# EasyEDA schematic SCH Token Function.json
TITLE: Token Function; REV: 1.0; Date: 2025-01-18; Sheet: 1/1; Company: OneOneZero
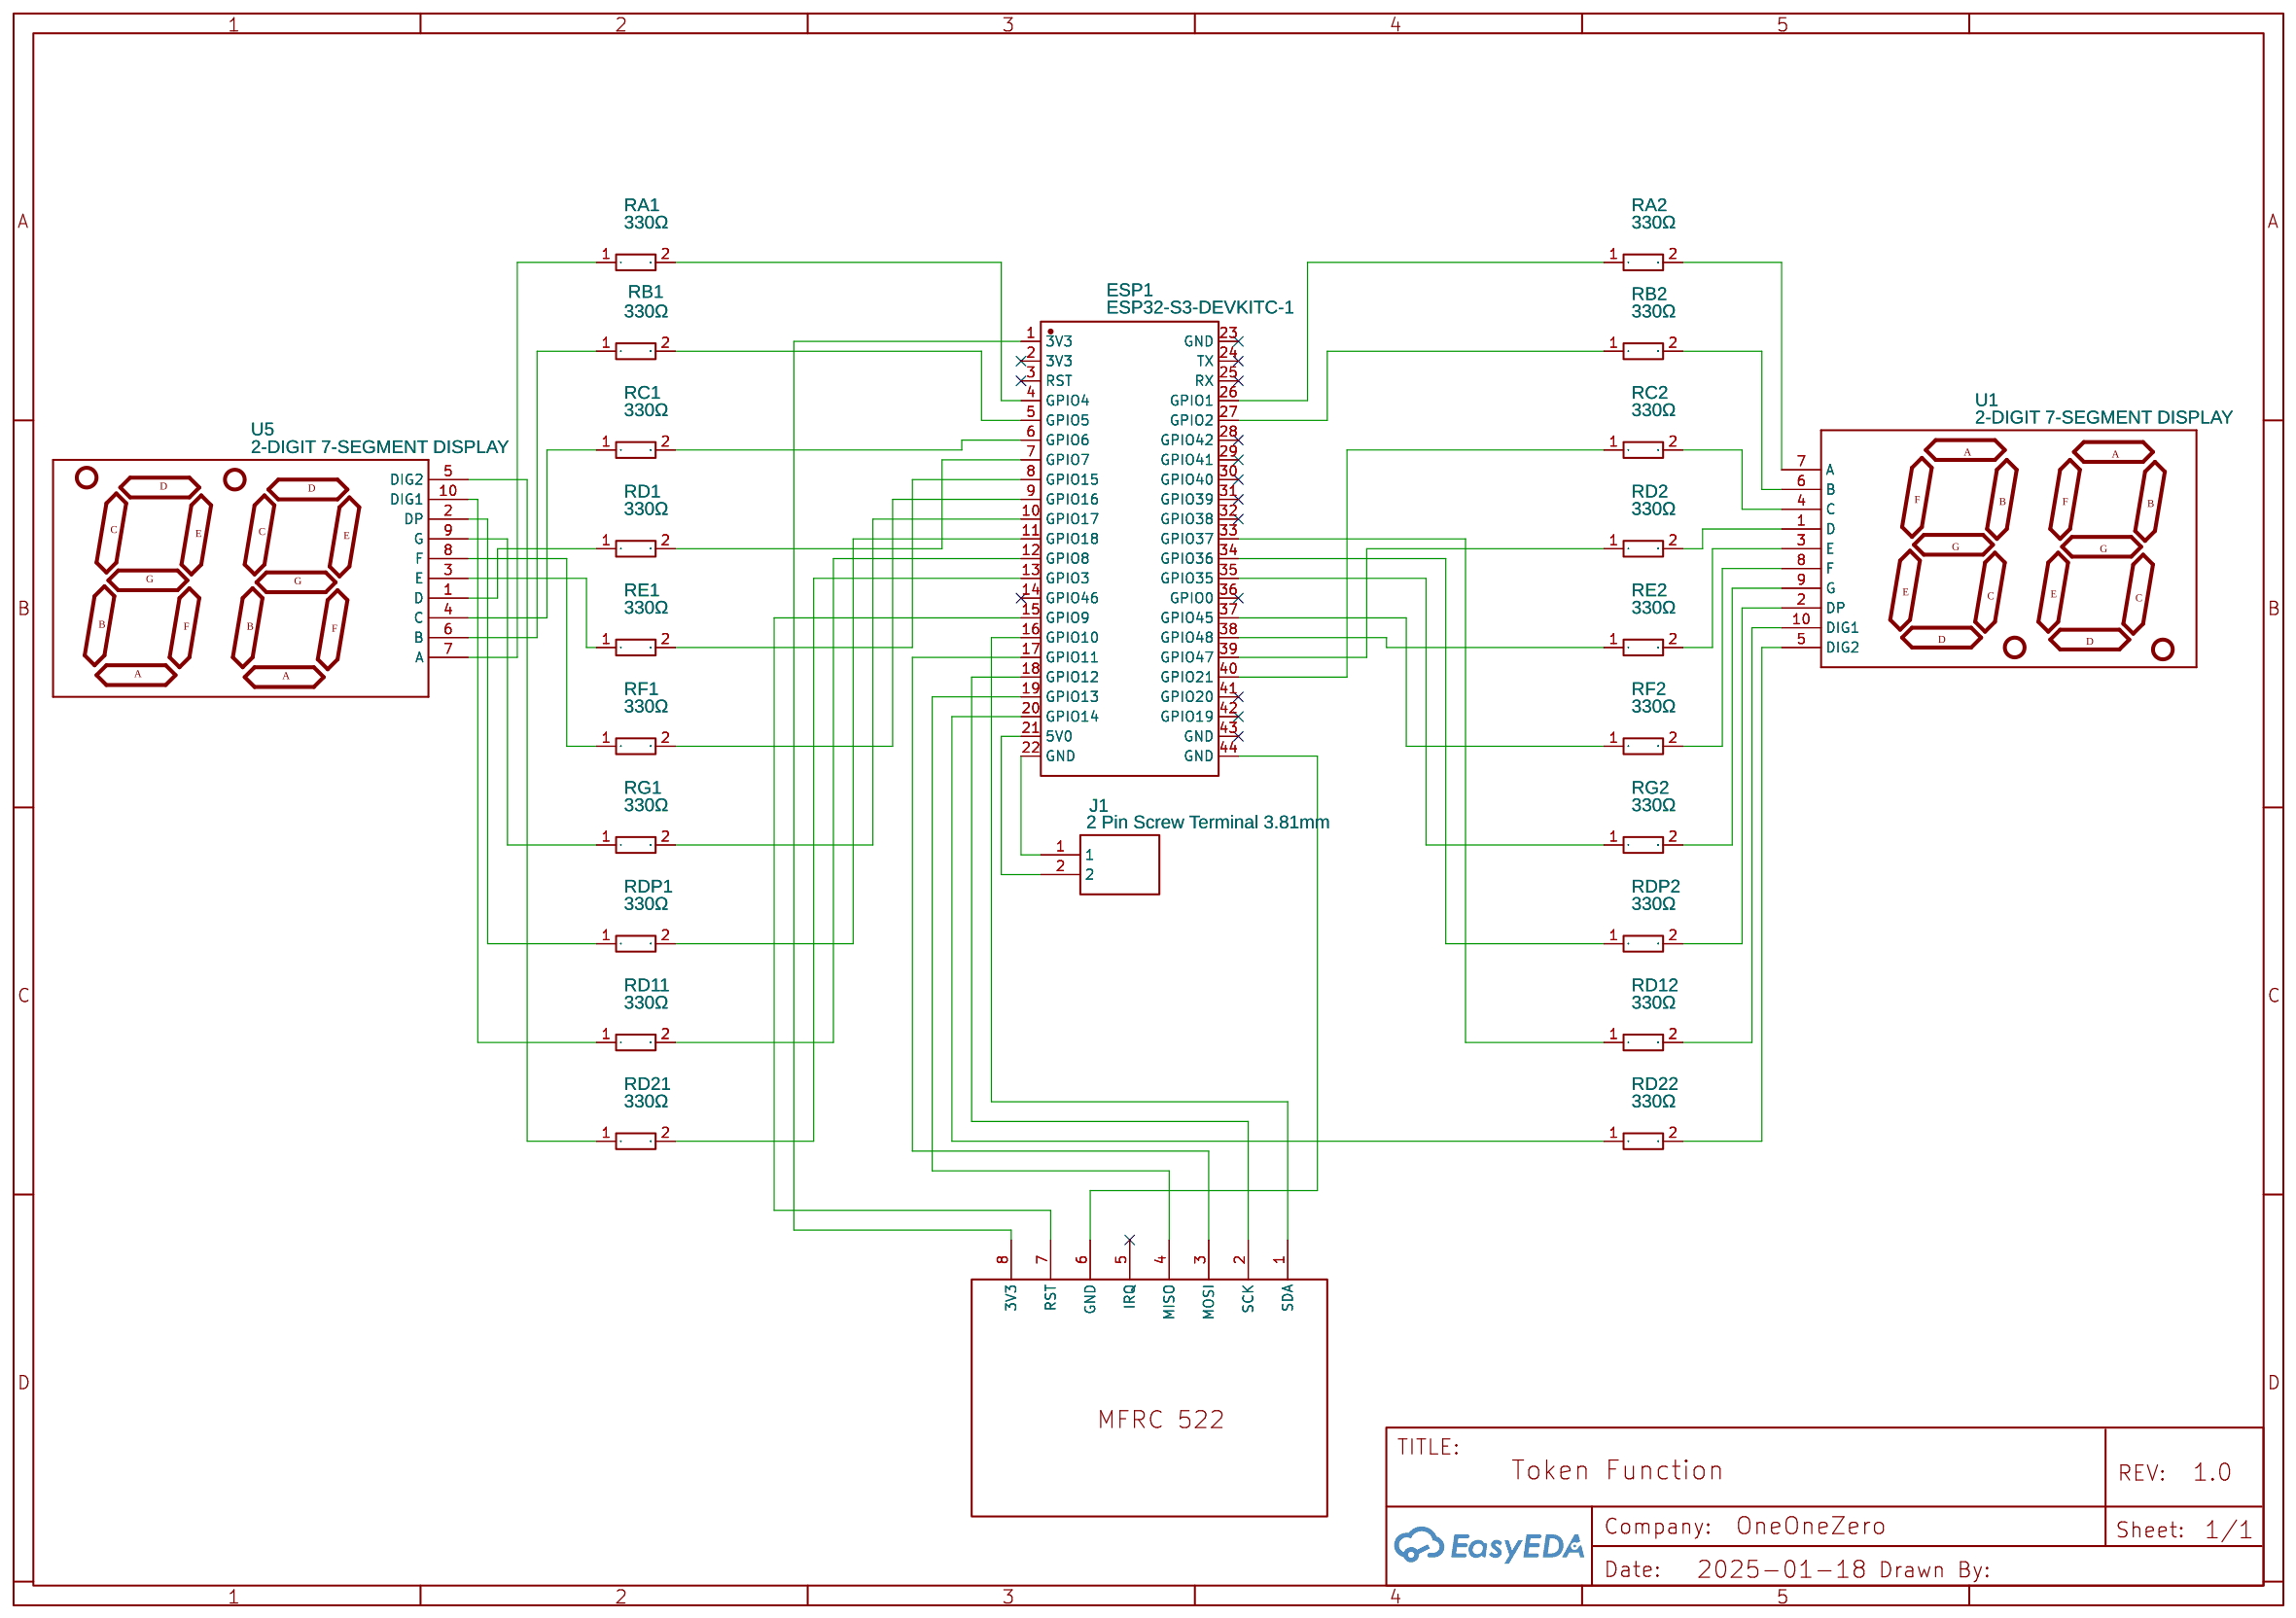
[diagram p0: schematic sheet]

## Parts
ESP1  ESP32-S3-DEVKITC-1  [ESP32-S3-DEVKITC-1]
J1  2 Pin Screw Terminal 3.81mm  [SCREW_TERMINAL_2PIN_3.81MMPITCH_F0.8]
RA1  330Ω  [V2-330Ω-THROUGH-HOLE-RESISTORS-5%-1/4W-D2.3-L6.5MM-FP]
RA2  330Ω  [V2-330Ω-THROUGH-HOLE-RESISTORS-5%-1/4W-D2.3-L6.5MM-FP]
RB1  330Ω  [V2-330Ω-THROUGH-HOLE-RESISTORS-5%-1/4W-D2.3-L6.5MM-FP]
RB2  330Ω  [V2-330Ω-THROUGH-HOLE-RESISTORS-5%-1/4W-D2.3-L6.5MM-FP]
RC1  330Ω  [V2-330Ω-THROUGH-HOLE-RESISTORS-5%-1/4W-D2.3-L6.5MM-FP]
RC2  330Ω  [V2-330Ω-THROUGH-HOLE-RESISTORS-5%-1/4W-D2.3-L6.5MM-FP]
RD1  330Ω  [V2-330Ω-THROUGH-HOLE-RESISTORS-5%-1/4W-D2.3-L6.5MM-FP]
RD2  330Ω  [V2-330Ω-THROUGH-HOLE-RESISTORS-5%-1/4W-D2.3-L6.5MM-FP]
RD11  330Ω  [V2-330Ω-THROUGH-HOLE-RESISTORS-5%-1/4W-D2.3-L6.5MM-FP]
RD12  330Ω  [V2-330Ω-THROUGH-HOLE-RESISTORS-5%-1/4W-D2.3-L6.5MM-FP]
RD21  330Ω  [V2-330Ω-THROUGH-HOLE-RESISTORS-5%-1/4W-D2.3-L6.5MM-FP]
RD22  330Ω  [V2-330Ω-THROUGH-HOLE-RESISTORS-5%-1/4W-D2.3-L6.5MM-FP]
RDP1  330Ω  [V2-330Ω-THROUGH-HOLE-RESISTORS-5%-1/4W-D2.3-L6.5MM-FP]
RDP2  330Ω  [V2-330Ω-THROUGH-HOLE-RESISTORS-5%-1/4W-D2.3-L6.5MM-FP]
RE1  330Ω  [V2-330Ω-THROUGH-HOLE-RESISTORS-5%-1/4W-D2.3-L6.5MM-FP]
RE2  330Ω  [V2-330Ω-THROUGH-HOLE-RESISTORS-5%-1/4W-D2.3-L6.5MM-FP]
RF1  330Ω  [V2-330Ω-THROUGH-HOLE-RESISTORS-5%-1/4W-D2.3-L6.5MM-FP]
RF2  330Ω  [V2-330Ω-THROUGH-HOLE-RESISTORS-5%-1/4W-D2.3-L6.5MM-FP]
RG1  330Ω  [V2-330Ω-THROUGH-HOLE-RESISTORS-5%-1/4W-D2.3-L6.5MM-FP]
RG2  330Ω  [V2-330Ω-THROUGH-HOLE-RESISTORS-5%-1/4W-D2.3-L6.5MM-FP]
U1  2-DIGIT 7-SEGMENT DISPLAY  [2 DIGIT]
U2  MFRC522-MODULE-FLIPPED  [MFRC522-MODULE-FLIPPED]
U5  2-DIGIT 7-SEGMENT DISPLAY  [2 DIGIT]

## Library data of the parts
ESP1 = ESP32-S3-DEVKITC-1: Contributor: lshutterli
J1 = 2 Pin Screw Terminal 3.81mm: Contributor: piazza
RA1 RA2 RB1 RB2 RC1 RC2 RD1 RD2 RD11 RD12 RD21 RD22 RDP1 RDP2 RE1 RE2 RF1 RF2 RG1 RG2 = V2-330Ω-THROUGH-HOLE-RESISTORS-5%-1/4W-D2.3-L6.5MM: Contributor: LCSC; Supplier: LCSC; Supplier Part: C119313; Manufacturer: CCO(千志电子); Manufacturer Part: MF1/4W-330Ω±1% T; JLCPCB Part Class: Extended Part
U1 U5 = 2-DIGIT 7-SEGMENT DISPLAY: Contributor: Ra.hulk
U2 = MFRC522-MODULE-FLIPPED: Contributor: flzurhorst

## Nets
Net-(ESP1-1): ESP1.1(3V3) U2.8(3V3)
Net-(ESP1-4): ESP1.4(GPIO4) RA1.2
Net-(ESP1-5): ESP1.5(GPIO5) RB1.2
Net-(ESP1-6): ESP1.6(GPIO6) RC1.2
Net-(ESP1-7): ESP1.7(GPIO7) RD1.2
Net-(ESP1-8): ESP1.8(GPIO15) RE1.2
Net-(ESP1-9): ESP1.9(GPIO16) RF1.2
Net-(ESP1-10): ESP1.10(GPIO17) RG1.2
Net-(ESP1-11): ESP1.11(GPIO18) RDP1.2
Net-(ESP1-12): ESP1.12(GPIO8) RD11.2
Net-(ESP1-13): ESP1.13(GPIO3) RD21.2
Net-(ESP1-15): ESP1.15(GPIO9) U2.7(RST)
Net-(ESP1-16): ESP1.16(GPIO10) U2.1(SDA)
Net-(ESP1-17): ESP1.17(GPIO11) U2.3(MOSI)
Net-(ESP1-18): ESP1.18(GPIO12) U2.2(SCK)
Net-(ESP1-19): ESP1.19(GPIO13) U2.4(MISO)
Net-(ESP1-20): ESP1.20(GPIO14) RD22.1
Net-(ESP1-21): ESP1.21(5V0) J1.2
Net-(ESP1-22): ESP1.22(GND) J1.1
Net-(ESP1-26): ESP1.26(GPIO1) RA2.1
Net-(ESP1-27): ESP1.27(GPIO2) RB2.1
Net-(ESP1-33): ESP1.33(GPIO37) RD12.1
Net-(ESP1-34): ESP1.34(GPIO36) RDP2.1
Net-(ESP1-35): ESP1.35(GPIO35) RG2.1
Net-(ESP1-37): ESP1.37(GPIO45) RF2.1
Net-(ESP1-38): ESP1.38(GPIO48) RE2.1
Net-(ESP1-39): ESP1.39(GPIO47) RD2.1
Net-(ESP1-40): ESP1.40(GPIO21) RC2.1
Net-(ESP1-44): ESP1.44(GND) U2.6(GND)
Net-(RA1-1): RA1.1 U5.7(A)
Net-(RA2-2): RA2.2 U1.7(A)
Net-(RB1-1): RB1.1 U5.6(B)
Net-(RB2-2): RB2.2 U1.6(B)
Net-(RC1-1): RC1.1 U5.4(C)
Net-(RC2-2): RC2.2 U1.4(C)
Net-(RD1-1): RD1.1 U5.1(D)
Net-(RD2-2): RD2.2 U1.1(D)
Net-(RD11-1): RD11.1 U5.10(DIG1)
Net-(RD12-2): RD12.2 U1.10(DIG1)
Net-(RD21-1): RD21.1 U5.5(DIG2)
Net-(RD22-2): RD22.2 U1.5(DIG2)
Net-(RDP1-1): RDP1.1 U5.2(DP)
Net-(RDP2-2): RDP2.2 U1.2(DP)
Net-(RE1-1): RE1.1 U5.3(E)
Net-(RE2-2): RE2.2 U1.3(E)
Net-(RF1-1): RF1.1 U5.8(F)
Net-(RF2-2): RF2.2 U1.8(F)
Net-(RG1-1): RG1.1 U5.9(G)
Net-(RG2-2): RG2.2 U1.9(G)

Not connected (* = marked no-connect by the designer): ESP1 2(3V3)* 3(RST)* 14(GPIO46)* 23(GND)* 24(TX)* 25(RX)* 28(GPIO42)* 29(GPIO41)* 30(GPIO40)* 31(GPIO39)* 32(GPIO38)* 36(GPIO0)* 41(GPIO20)* 42(GPIO19)* 43(GND)*; U2 5(IRQ)*
